# EAGLE design pic24rgbrnd01-r1 (EAGLE 7.4.0)
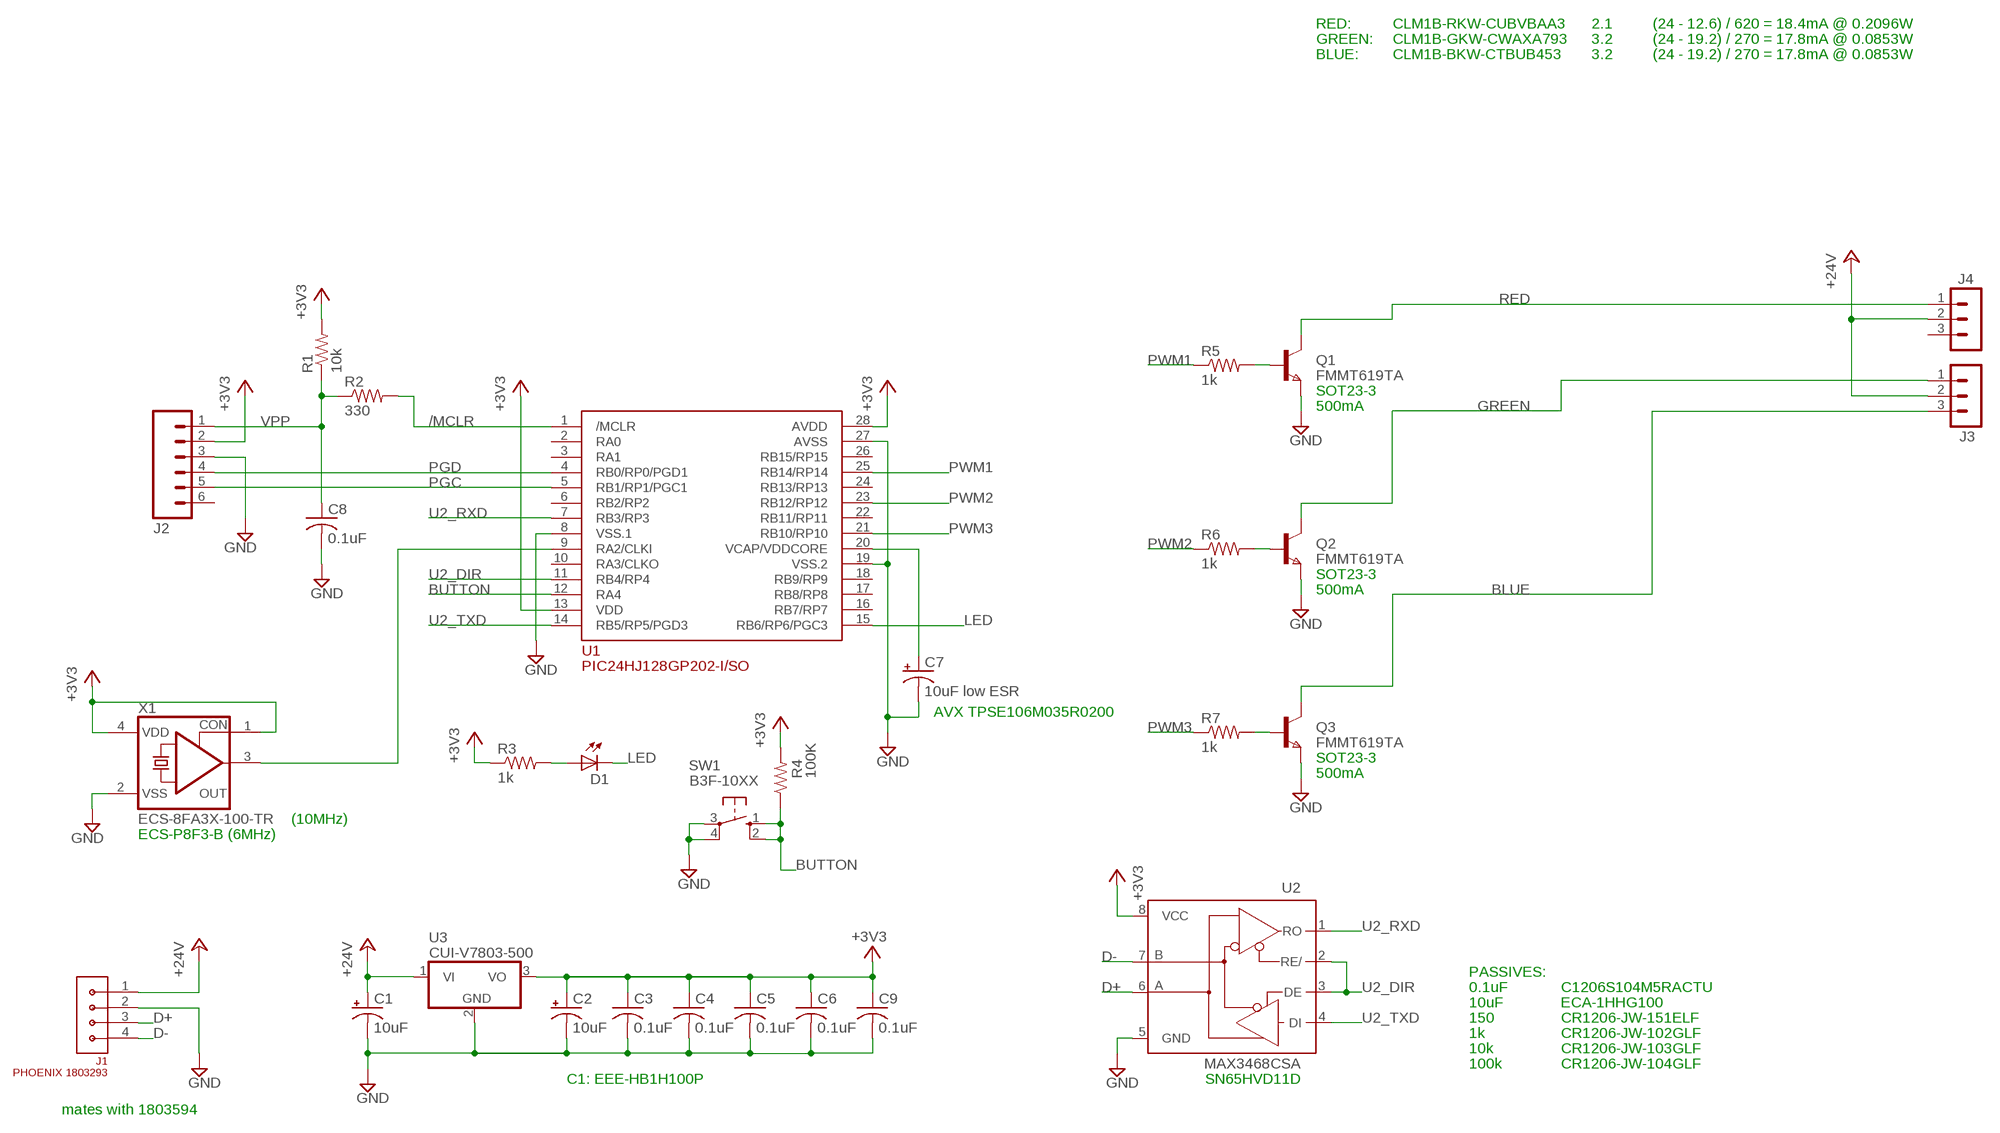
[diagram p0: schematic, sheet 1]

## Parts
C1  10uF  CPOL-USD  [PANASONIC_D]
C2  10uF  CPOL-USD  [PANASONIC_D]
C3  0.1uF  C-USC1206  [C1206]
C4  0.1uF  C-USC1206  [C1206]
C5  0.1uF  C-USC1206  [C1206]
C6  0.1uF  C-USC1206  [C1206]
C7  10uF low ESR  CPOL-USD/7343-31R  [D/7343-31R]
C8  0.1uF  C-USC1206  [C1206]
C9  0.1uF  C-USC1206  [C1206]
D1  LED3MM  [LED3MM]
J1  PHOENIX 1803293  CON-3.81MM-1X4-PHOENIX-1803293  [CON-PHOENIX-1803293-3.81-1X4]
J2  M06SIP  [1X06]
J3  MA03-1  [MA03-1]
J4  MA03-1  [MA03-1]
Q1  FMMT619TA  NPNSOT23  [SOT-23]
Q2  FMMT619TA  NPNSOT23  [SOT-23]
Q3  FMMT619TA  NPNSOT23  [SOT-23]
R1  10k  R-US_R1206  [R1206]
R2  330  R-US_R1206  [R1206]
R3  1k  R-US_R1206  [R1206]
R4  100K  R-US_M1206  [M1206]
R5  1k  R-US_R1206  [R1206]
R6  1k  R-US_R1206  [R1206]
R7  1k  R-US_R1206  [R1206]
SW1  B3F-10XX  10-XX  [B3F-10XX]
U1  PIC24HJ128GP202-I/SO  [SO28W]
U2  MAX3468CSA  [SO08]
U3  CUI-V7803-500  [CUI-78XX-500]
X1  ECS-8FA3X-100-TR  CRYSTAL_RES-1100S  [1100S]

## Nets
+3V3: C2.+ C3.1 C4.1 C5.1 C6.1 C9.1 J2.2 R1.2 R3.1 R4.2 U1.13(VDD) U1.28(AVDD) U2.8(VCC) U3.3(VO) X1.1(CON) X1.4(VDD)
+24V: C1.+ J1.1 J3.2 J4.2 U3.1(VI)
/MCLR: R2.2 U1.1(/MCLR)
BLUE: J3.3 Q3.1(C)
BUTTON: R4.1 SW1.1(S) SW1.2(S1) U1.12(RA4)
D+: J1.3 U2.6(A)
D-: J1.4 U2.7(B)
GND: C1.- C2.- C3.2 C4.2 C5.2 C6.2 C7.- C8.2 C9.2 J1.2 J2.3 Q1.2(E) Q2.2(E) Q3.2(E) SW1.3(P) SW1.4(P1) U1.8(VSS.1) U1.19(VSS.2) U1.27(AVSS) U2.5(GND) U3.2(GND) X1.2(VSS)
GREEN: J3.1 Q2.1(C)
LED: D1.K(C) U1.15(RB6/RP6/PGC3)
N$4: C7.+ U1.20(VCAP/VDDCORE)
N$5: U1.9(RA2/CLKI) X1.3(OUT)
N$112: Q1.3(B) R5.2
N$113: Q2.3(B) R6.2
N$114: Q3.3(B) R7.2
N$115: D1.A R3.2
PGC: J2.5 U1.5(RB1/RP1/PGC1)
PGD: J2.4 U1.4(RB0/RP0/PGD1)
PWM1: R5.1 U1.25(RB14/RP14)
PWM2: R6.1 U1.23(RB12/RP12)
PWM3: R7.1 U1.21(RB10/RP10)
RED: J4.1 Q1.1(C)
U2_DIR: U1.11(RB4/RP4) U2.2(RE/) U2.3(DE)
U2_RXD: U1.7(RB3/RP3) U2.1(RO)
U2_TXD: U1.14(RB5/RP5/PGD3) U2.4(DI)
VPP: C8.1 J2.1 R1.1 R2.1
Unconnected: J2.6 J4.3 U1.2(RA0) U1.3(RA1) U1.6(RB2/RP2) U1.10(RA3/CLKO) U1.16(RB7/RP7) U1.17(RB8/RP8) U1.18(RB9/RP9) U1.22(RB11/RP11) U1.24(RB13/RP13) U1.26(RB15/RP15)

## Notes on the sheet
- RED: | CLM1B-RKW-CUBVBAA3 | 2.1 | (24 - 12.6) / 620 = 18.4mA @ 0.2096W
- GREEN: | CLM1B-GKW-CWAXA793 | 3.2 | (24 - 19.2) / 270 = 17.8mA @ 0.0853W
- BLUE: | CLM1B-BKW-CTBUB453 | 3.2 | (24 - 19.2) / 270 = 17.8mA @ 0.0853W
- SOT23-3
- 500mA
- SOT23-3
- 500mA
- AVX TPSE106M035R0200
- SOT23-3
- 500mA
- (10MHz)
- ECS-P8F3-B (6MHz)
- PASSIVES:
- 0.1uF | C1206S104M5RACTU
- 10uF | ECA-1HHG100
- 150 | CR1206-JW-151ELF
- 1k | CR1206-JW-102GLF
- 10k | CR1206-JW-103GLF
- 100k | CR1206-JW-104GLF
- C1: EEE-HB1H100P | SN65HVD11D
- mates with 1803594

## Library data of the parts
C1 C2 C7 = rcl:CPOL-US: POLARIZED CAPACITOR, American symbol
C3-C6 C8 C9 = rcl:C-US: CAPACITOR, American symbol
D1 = led:LED: LED OSRAM: - CHIPLED LG R971, LG N971, LY N971, LG Q971, LY Q971, LO R971, LY R971 LH N974, LH R974 LS Q976, LO Q976, LY Q976 LO Q996 - Hyper CHIPLED LW Q18S LB Q993, LB Q99A, LB R99A - SideLED LS A670, LO A670, LY A670, LG A670, LP A670 LB A673, LV A673, LT A673, LW A673 LH A674 LY A675 LS A676, LA A676, LO A676, LY A676, LW A676 LS A679, LY A679, LG A679 - Hyper Micro SIDELED® LS Y876, LA Y876, LO Y876, LY Y876 LT Y87S - SmartLED LW L88C, LW L88S LB L89C, LB L89S, LG L890 LS L89K, LO L89K, LY L89K LS L896, LA L896, LO L896, LY L896 - TOPLED LS T670, LO T670, LY T670, LG T670, LP T670 LSG T670, LSP T670, LSY T670, LOP T670, LYG T670 LG T671, LOG T671, LSG T671 LB T673, LV T673, LT T673, LW T673 LH T674 LS T676, LA T676, LO T676, LY T676, LB T676, LH T676, LSB T676, LW T676 LB T67C, LV T67C, LT T67C, LS T67K, LO T67K, LY T67K, LW E67C LS E67B, LA E67B, LO E67B, LY E67B, LB E67C, LV E67C, LT E67C LW T67C LS T679, LY T679, LG T679 LS T770, LO T770, LY T770, LG T770, LP T770 LB T773, LV T773, LT T773, LW T773 LH T774 LS E675, LA E675, LY E675, LS T675 LS T776, LA T776, LO T776, LY T776, LB T776 LHGB T686 LT T68C, LB T68C - Hyper Mini TOPLED® LB M676 - Mini TOPLED Santana® LG M470 LS M47K, LO M47K, LY M47K Source: http://www.osram.convergy.de LUXEON: - LUMILED® LXK2-PW12-R00, LXK2-PW12-S00, LXK2-PW14-U00, LXK2-PW14-V00 LXK2-PM12-R00, LXK2-PM12-S00, LXK2-PM14-U00 LXK2-PE12-Q00, LXK2-PE12-R00, LXK2-PE12-S00, LXK2-PE14-T00, LXK2-PE14-U00 LXK2-PB12-K00, LXK2-PB12-L00, LXK2-PB12-M00, LXK2-PB14-N00, LXK2-PB14-P00, LXK2-PB14-Q00 LXK2-PR12-L00, LXK2-PR12-M00, LXK2-PR14-Q00, LXK2-PR14-R00 LXK2-PD12-Q00, LXK2-PD12-R00, LXK2-PD12-S00 LXK2-PH12-R00, LXK2-PH12-S00 LXK2-PL12-P00, LXK2-PL12-Q00, LXK2-PL12-R00 Source: www.luxeon.com KINGBRIGHT: KA-3528ASYC Source: www.kingbright.com
J1 = 0GlenConnectors:CON-3.81MM-1X4-PHOENIX-1803293
J2 = SparkFun-Connectors:M06: Header 6 Standard 6-pin 0.1" header. Use with straight break away headers (SKU : PRT-00116), right angle break away headers (PRT-00553), swiss pins (PRT-00743), machine pins (PRT-00117), and female headers (PRT-00115). Molex polarized connector foot print use with SKU : PRT-08094 with associated crimp pins and housings. NOTES ON THE VARIANTS LOCK and LOCK_LONGPADS... This footprint was designed to help hold the alignment of a through-hole component (i.e. 6-pin header) while soldering it into place. You may notice that each hole has been shifted either up or down by 0.005 of an inch from it's more standard position (which is a perfectly straight line). This slight alteration caused the pins (the squares in the middle) to touch the edges of the holes. Because they are alternating, it causes a "brace" to hold the component in place. 0.005 has proven to be the perfect amount of "off-center" position when using our standard breakaway headers. Although looks a little odd when you look at the bare footprint, once you have a header in there, the alteration is very hard to notice. Also,if you push a header all the way into place, it is covered up entirely on the bottom side. This idea of altering the position of holes to aid alignment will be further integrated into the Sparkfun Library for other footprints. It can help hold any component with 3 or more connection pins.
J3 J4 = con-lstb:MA03-1: PIN HEADER
Q1-Q3 = zetex:NPNSOT23: NPN TRANSISTOR; MPN: DSS20201L-7; OC_FARNELL: 1710688; OC_NEWARK: 25R4555
R1-R7 = rcl:R-US_: RESISTOR, American symbol
SW1 = switch-omron:10-XX: OMRON SWITCH
U1 = GlenPartsLibrary:PIC24HJ128GP202-I/SO
U2 = maxim:MAX34*: +5V, Fail-Safe, 40Mbps, Profibus RS-485/RS-422 Transceivers Source: MAX3465-MAX3469.pdf; MPN: MAX3468CSA+; OC_FARNELL: unknown; OC_NEWARK: 76K6721
U3 = GlenPartsLibrary:CUI-V7803-500
X1 = crystal:CRYSTAL_RES-: CRYSTAL RESONATOR; OC_FARNELL: unknown; OC_NEWARK: unknown

## Board
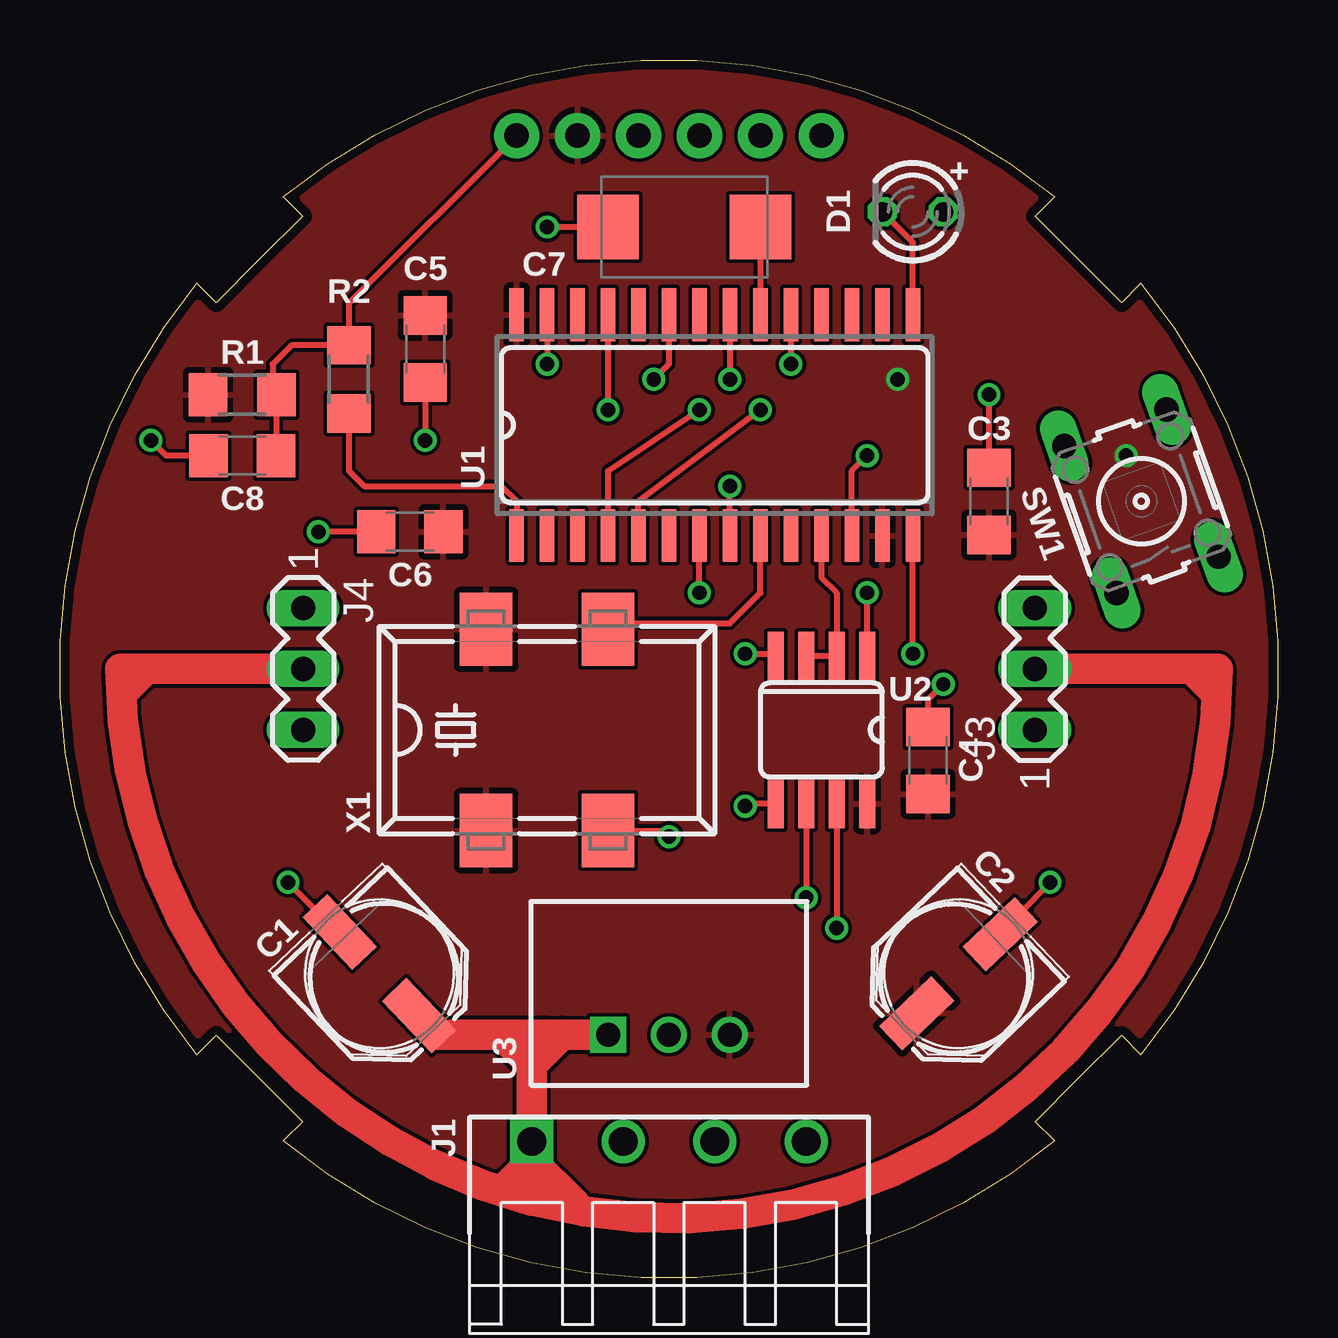
[diagram p1: board, top side]
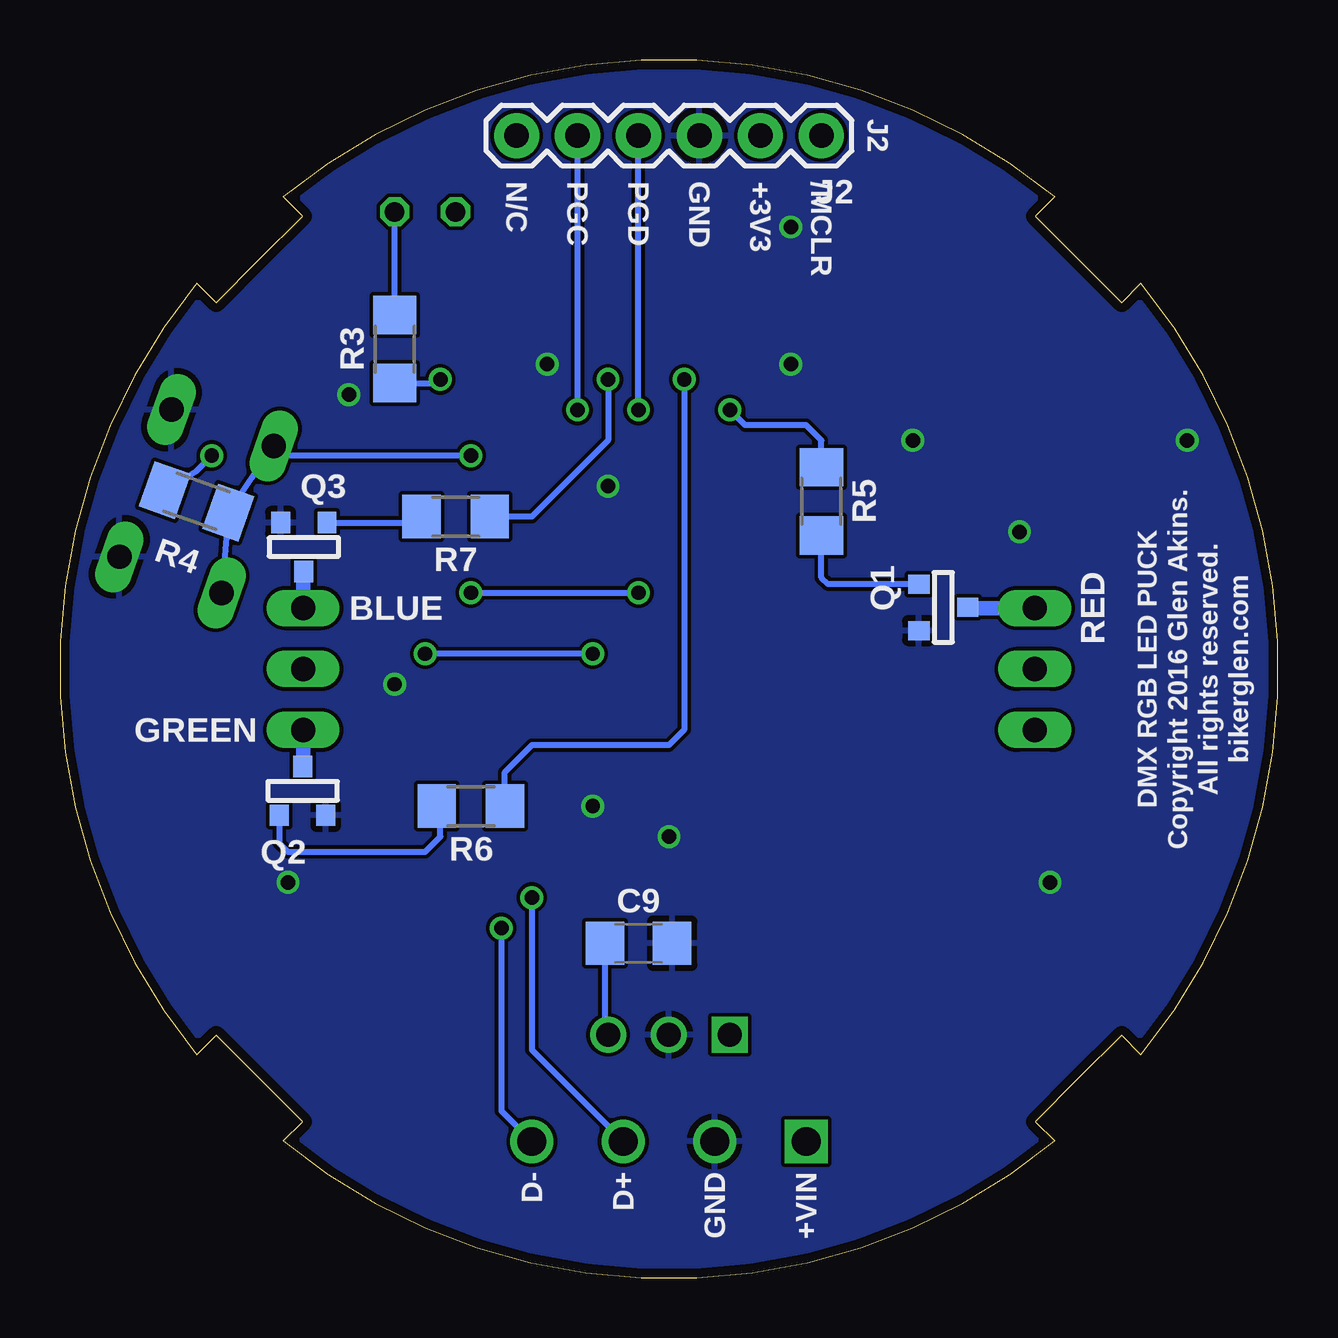
[diagram p2: board, bottom side, seen from below]

Size 50.75 x 50.75 mm. Coordinates in mm from the lower left corner, seen from the top.
Outline: 5.71,9.3 arc-79 5.71,41.45 6.51,40.64 8.31,42.44 10.11,44.23 9.3,45.04 arc-79 41.45,45.04 40.64,44.23 42.44,42.44 44.23,40.64 45.04,41.45 arc-79 45.04,9.3 44.23,10.11 42.44,8.31 40.64,6.51 41.45,5.71 arc-79 9.3,5.71 10.11,6.51 8.31,8.31 6.51,10.11 5.71,9.3
Copper layers (1*16): Top 0.0356mm / dielectric 1.5011mm / Bottom 0.0356mm
Design rules "LaenPCBOrder": minimum track width 6mil, minimum drill 13mil, track to track 6mil, track to pad 6mil, pad to pad 6mil, via to via 6mil, smd to smd 6mil, copper to edge 15mil, drill to drill 6mil, minimum pad ring 7mil, minimum via ring 7mil, stop-mask expansion 4mil, vias tented up to drill 0mil, thermal gap 10mil
tKeepout: area 6.5,38.8 to 11.9,44.2; area 6.5,6.5 to 11.9,11.9; area 38.8,38.8 to 44.2,44.2; area 38.8,6.5 to 44.2,11.9
bKeepout: area 6.5,38.8 to 11.9,44.2; area 38.8,38.8 to 44.2,44.2; area 38.8,6.5 to 44.2,11.9; area 6.5,6.5 to 11.9,11.9

### Footprints (pad centres in the part's own frame; a part is rotated, then mirrored left to right if it is on the bottom)
PANASONIC_D = smd 3 x 1.4: + 2.4,0; - -2.4,0
C1206 = smd 1.6 x 1.8: 1 -1.4,0; 2 1.4,0
D/7343-31R = smd 2.55 x 2.7: + 3.175,0; - -3.175,0
LED3MM = drill 0.813 octagon: A -1.27,0; K 1.27,0
CON-PHOENIX-1803293-3.81-1X4 = drill 1.2 square: 1 0,0 | drill 1.2: 2 3.81,0; 3 7.62,0; 4 11.43,0
1X06 = drill 1.016 pad 1.88: 1 0,0; 2 2.54,0; 3 5.08,0; 4 7.62,0; 5 10.16,0; 6 12.7,0
MA03-1 = drill 1.016 long: 1 -2.54,0; 2 0,0; 3 2.54,0
SOT-23 = smd 0.787 x 0.889: 1 0.025,-1.016; 2 -0.94,1.016; 3 0.991,1.016
R1206 = smd 1.6 x 1.803: 1 -1.422,0; 2 1.422,0
M1206 = smd 1.6 x 2: 1 -1.4,0; 2 1.4,0
B3F-10XX = drill 1.016 long: 1 -3.251,2.261; 2 3.251,2.261; 3 -3.251,-2.261; 4 3.251,-2.261
SO28W = smd 0.6 x 2.2: 1 -8.255,-4.6; 2 -6.985,-4.6; 3 -5.715,-4.6; 4 -4.445,-4.6; 5 -3.175,-4.6; 6 -1.905,-4.6; 7 -0.635,-4.6; 8 0.635,-4.6; 9 1.905,-4.6; 10 3.175,-4.6; 11 4.445,-4.6; 12 5.715,-4.6; 13 6.985,-4.6; 14 8.255,-4.6; 15 8.255,4.6; 16 6.985,4.6; 17 5.715,4.6; 18 4.445,4.6; 19 3.175,4.6; 20 1.905,4.6; 21 0.635,4.6; 22 -0.635,4.6; 23 -1.905,4.6; 24 -3.175,4.6; 25 -4.445,4.6; 26 -5.715,4.6; 27 -6.985,4.6; 28 -8.255,4.6
SO08 = smd 0.66 x 2.032: 1 -1.905,-3.073; 2 -0.635,-3.073; 3 0.635,-3.073; 4 1.905,-3.073; 5 1.905,3.073; 6 0.635,3.073; 7 -0.635,3.073; 8 -1.905,3.073
CUI-78XX-500 = drill 1 square: 1 0,0 | drill 1: 2 2.54,0; 3 5.08,0
1100S = smd 2.184 x 3.048: 1 -2.54,-4.191; 2 2.54,-4.191; 3 2.54,4.191; 4 -2.54,4.191

### Placement (x,y rotation side)
C1  13.31,12.67 313.5 top
C2  37.44,12.67 223.5 top
C3  38.71,32.36 90 top
C4  36.17,21.56 90 top
C5  15.21,38.71 270 top
C6  14.58,31.09 180 top
C7  26.01,43.79 0 top
C8  7.59,34.26 180 top
C9  26.64,13.94 0 bottom
D1  35.53,44.42 180 top
J1  19.66,5.69 0 top
J2  19.02,47.6 180 bottom
J3  40.61,25.37 90 top
J4  10.13,25.37 270 top
Q1  13.94,27.91 90 bottom
Q2  40.61,20.29 180 bottom
Q3  40.61,30.45 0 bottom
R1  7.59,36.8 180 top
R2  12.04,37.44 270 top
R3  36.8,38.71 90 bottom
R4  45.06,32.36 160.5 bottom
R5  19.02,32.36 270 bottom
R6  33.63,19.66 180 bottom
R7  34.26,31.72 180 bottom
SW1  45.06,32.36 109.5 top
U1  27.28,35.53 0 top
U2  31.72,22.83 180 top
U3  22.83,10.13 0 top
X1  20.29,22.83 0 top

### Tracks (layer width: path | path; a pad name or v marks a point on that pad's centre or on a via)
+3V3  (via drill 0.6)
  Bottom 0.254: C9.1 28.04,10.26 U3.3 | R4.2 45.06,33.63 v44.42,34.26 | R3.1 35.05,37.29 v34.9,37.44
  pour Top: 5.71,41.45 6.52,40.64 10.11,44.23 9.3,45.04 arc-79 41.45,45.04 40.64,44.23 44.23,40.64 45.04,41.45 arc-79 45.04,9.3 44.23,10.11 40.64,6.52 41.45,5.71 arc-79 9.3,5.71 10.11,6.52 6.52,10.11 5.71,9.3 arc-79
+24V
  Top 1.016: 19.66,3.22 19.66,5.05 | 19.66,5.05 J1.1 | 3.78,25.37 2.51,24.1 | 46.96,25.37 48.23,24.1 | 19.66,5.05 18.39,3.78 | 19.66,5.05 21.56,3.15 20.93,3.15 20.29,3.78
  Top 1.27: 19.66,9.5 20.29,10.13 | 20.29,10.13 20.93,10.13 | 20.93,10.13 U3.1 | J1.1 19.66,8.86 | 19.66,8.86 19.66,9.5 | 19.66,9.5 19.02,10.13 | 19.02,10.13 18.39,10.13 | 18.39,10.13 15.71,10.13 C1.+ | 18.39,10.13 19.66,8.86 | 19.66,8.86 20.93,10.13 | 20.29,10.13 19.02,10.13 | J4.2 3.78,25.37 2.51,25.37 arc75 19.66,3.22 arc105 48.23,25.37 46.96,25.37 J3.2
/MCLR
  Top 0.254: U1.1 19.02,32.36 18.39,32.99 12.67,32.99 12.04,33.63 R2.2
BLUE
  Bottom 0.61: J3.3 40.61,29.41 Q3.1
BUTTON  (via drill 0.6)
  Top 0.254: U1.12 32.99,33.63 v33.63,34.26
  Bottom 0.254: v33.63,34.26 42.07,34.26 SW1.2 R4.1 SW1.1
D+  (via drill 0.6)
  Top 0.254: U2.6 v31.09,15.85
  Bottom 0.254: v31.09,15.85 31.09,9.5 J1.3
D-  (via drill 0.6)
  Top 0.254: U2.7 v32.36,14.58
  Bottom 0.254: v32.36,14.58 32.36,6.96 J1.4
GND  (via drill 0.6)
  Top 0.254: C1.- 11.61,14.37 v9.5,16.48 | C2.- v41.25,16.48 | U1.27 v20.29,38.07 | C5.2 v15.21,34.9 | C6.2 v10.77,31.09 | C8.2 4.42,34.26 v3.78,34.9 | U2.5 28.65,19.76 v28.55,19.66 | X1.2 25.12,18.64 v25.37,18.39 | C4.2 36.17,24.1 v36.8,24.74 | C7.- v20.29,43.79 | C3.2 v38.71,36.8 | U1.19 v30.45,38.07 | U1.8 v27.91,32.99
  pour Bottom: 5.71,41.45 6.52,40.64 10.11,44.23 9.3,45.04 arc-79 41.45,45.04 40.64,44.23 44.23,40.64 45.04,41.45 arc-79 45.04,9.3 44.23,10.11 40.64,6.52 41.45,5.71 arc-79 9.3,5.71 10.11,6.52 6.52,10.11 5.71,9.3 arc-79
GREEN
  Bottom 0.61: J3.1 40.61,21.33 Q2.1
LED
  Top 0.254: U1.15 35.53,43.15 D1.K
N$4
  Top 0.254: C7.+ U1.20
N$5
  Top 0.254: X1.3 23.21,27.02 23.47,27.28 27.91,27.28 29.18,28.55 U1.9
N$112
  Bottom 0.254: Q1.3 18.74,28.9 19.02,29.18 R5.2
N$113
  Bottom 0.254: Q2.3 41.6,18.11 41.25,17.75 35.53,17.75 34.9,18.39 34.9,19.51 R6.2
N$114
  Bottom 0.254: Q3.3 35.94,31.47 R7.2
N$115
  Bottom 0.254: R3.2 D1.A
PGC  (via drill 0.6)
  Top 0.254: U1.5 24.1,32.36 v29.18,36.17
  Bottom 0.254: v29.18,36.17 J2.5
PGD  (via drill 0.6)
  Top 0.254: U1.4 22.83,33.63 v26.64,36.17
  Bottom 0.254: v26.64,36.17 J2.4
PWM1  (via drill 0.6)
  Top 0.254: v22.83,36.17 U1.25
  Bottom 0.254: R5.1 19.02,34.9 19.66,35.53 22.2,35.53 v22.83,36.17
PWM2  (via drill 0.6)
  Top 0.254: U1.23 25.37,38.07 v24.74,37.44
  Bottom 0.254: v24.74,37.44 24.74,22.83 25.37,22.2 31.09,22.2 32.21,21.08 R6.1
PWM3  (via drill 0.6)
  Top 0.254: U1.21 v27.91,37.44
  Bottom 0.254: v27.91,37.44 27.91,34.9 31.09,31.72 R7.1
RED
  Bottom 0.61: J4.1 12.9,27.91 Q1.1
U2_DIR
  Top 0.254: U2.3 U2.2 32.36,28.55 31.72,29.18 U1.11
U2_RXD  (via drill 0.6)
  Top 0.254: U2.1 v33.63,28.55 | v26.64,28.55 U1.7
  Bottom 0.254: v33.63,28.55 v26.64,28.55
U2_TXD  (via drill 0.6)
  Top 0.254: v35.53,26.01 U1.14 | v28.55,26.01 29.72,26.01 U2.4
  Bottom 0.254: v28.55,26.01 v35.53,26.01
VPP
  Top 0.254: C8.1 9.02,34.29 R1.1 8.86,36.96 8.86,38.07 9.65,38.86 R2.1 12.04,40.61 J2.1

### Text on the board
_tsilk: +
_bsilk: J2 | /MCLR | +3V3 | GND | PGD | PGC | N/C | RED | BLUE | bikerglen.com | All rights reserved. | Copyright 2016 Glen Akins. | DMX RGB LED PUCK | GREEN | +VIN | GND | D+ | D-